# EAGLE schematic Environmental Module - Board (EAGLE 8.3.0)
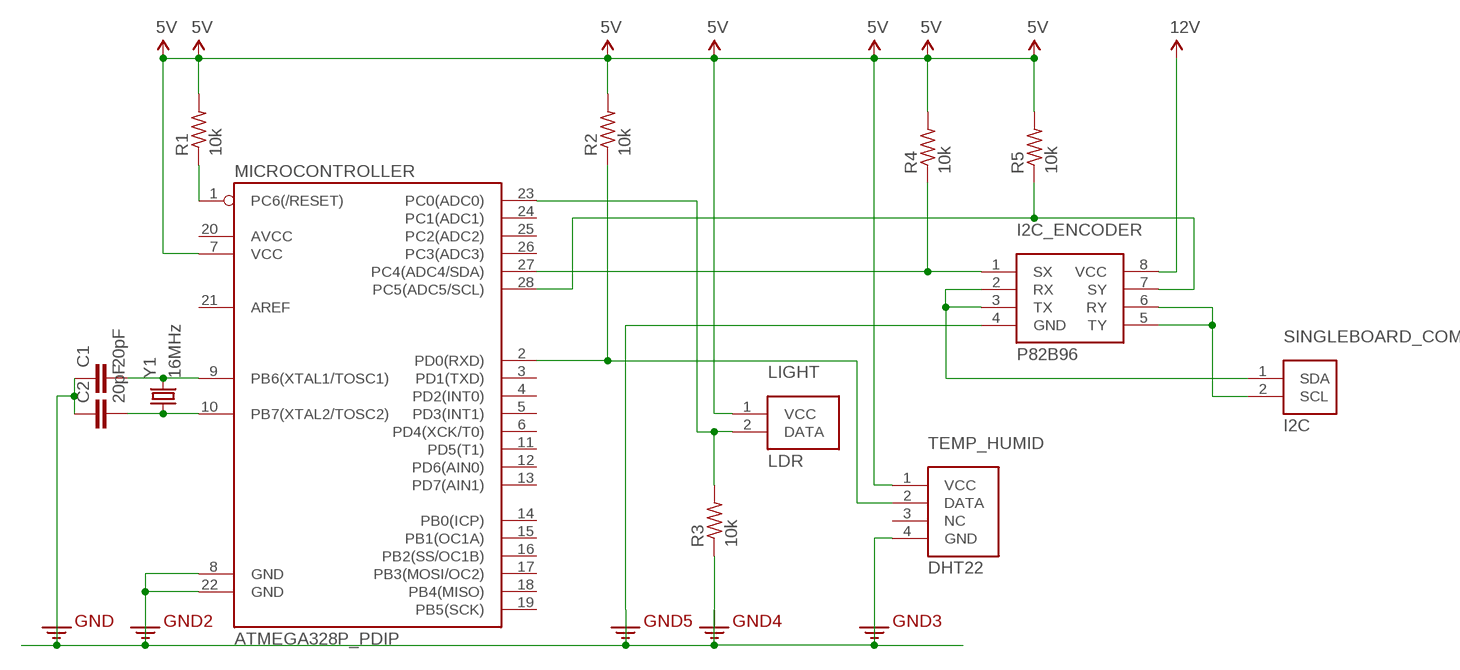
[diagram p0: schematic, sheet 1]

## Parts
C1  20pF  CAPPTH  [CAP-PTH-SMALL]
C2  20pF  CAPPTH  [CAP-PTH-SMALL]
I2C_ENCODER  P82B96  [SOIC8]
LIGHT  LDR  [LDR]
MICROCONTROLLER  ATMEGA328P_PDIP  [DIL28-3]
R1  10k  R-US_0204/7  [0204/7]
R2  10k  R-US_0204/7  [0204/7]
R3  10k  R-US_0204/7  [0204/7]
R4  10k  R-US_0204/7  [0204/7]
R5  10k  R-US_0204/7  [0204/7]
SINGLEBOARD_COMP  I2C  [LDR]
TEMP_HUMID  DHT22  [DHT22]
Y1  16MHz  CRYSTALHC49US  [HC49US]

## Nets
3.3V: C1.1 C2.1 I2C_ENCODER.4(GND) MICROCONTROLLER.8(GND) MICROCONTROLLER.22(GND) R3.1 TEMP_HUMID.4(GND) ; supply symbol labelled GND2
5V: LIGHT.1(VCC) MICROCONTROLLER.7(VCC) R1.2 R2.2 R4.2 R5.2 TEMP_HUMID.1(VCC)
12V: I2C_ENCODER.8(VCC)
N$2: I2C_ENCODER.7(SY) MICROCONTROLLER.28(PC5(ADC5/SCL)) R5.1
N$3: MICROCONTROLLER.1(PC6(/RESET)) R1.1
N$4: I2C_ENCODER.5(TY) I2C_ENCODER.6(RY) SINGLEBOARD_COMP.2(SCL)
N$5: I2C_ENCODER.1(SX) MICROCONTROLLER.27(PC4(ADC4/SDA)) R4.1
N$9: MICROCONTROLLER.2(PD0(RXD)) R2.1 TEMP_HUMID.2(DATA)
N$10: LIGHT.2(DATA) MICROCONTROLLER.23(PC0(ADC0)) R3.2
N$11: I2C_ENCODER.2(RX) I2C_ENCODER.3(TX) SINGLEBOARD_COMP.1(SDA)
N$12: C2.2 MICROCONTROLLER.10(PB7(XTAL2/TOSC2)) Y1.1
N$20: C1.2 MICROCONTROLLER.9(PB6(XTAL1/TOSC1)) Y1.2
Unconnected: MICROCONTROLLER.3(PD1(TXD)) MICROCONTROLLER.4(PD2(INT0)) MICROCONTROLLER.5(PD3(INT1)) MICROCONTROLLER.6(PD4(XCK/T0)) MICROCONTROLLER.11(PD5(T1)) MICROCONTROLLER.12(PD6(AIN0)) MICROCONTROLLER.13(PD7(AIN1)) MICROCONTROLLER.14(PB0(ICP)) MICROCONTROLLER.15(PB1(OC1A)) MICROCONTROLLER.16(PB2(SS/OC1B)) MICROCONTROLLER.17(PB3(MOSI/OC2)) MICROCONTROLLER.18(PB4(MISO)) MICROCONTROLLER.19(PB5(SCK)) MICROCONTROLLER.20(AVCC) MICROCONTROLLER.21(AREF) MICROCONTROLLER.24(PC1(ADC1)) MICROCONTROLLER.25(PC2(ADC2)) MICROCONTROLLER.26(PC3(ADC3)) TEMP_HUMID.3(NC)

## Library data of the parts
C1 C2 = SparkFun-Capacitors:CAP: Capacitor Standard 0603 ceramic capacitor, and 0.1" leaded capacitor.
I2C_ENCODER = 003_P82B96:P82B96: P82B96 - I2C buffer
LIGHT = 000_CropQuant:LDR
MICROCONTROLLER = SparkFun-DigitalIC:ATMEGA328P_PDIP: uC used in the Arduino 32kb flash, 1k EEPROM, 2k SRAM This is the through-hole version of this chip.
R1-R5 = resistor:R-US_: RESISTOR, American symbol
SINGLEBOARD_COMP = 000_CropQuant:I2C
TEMP_HUMID = 000_CropQuant:DHT22
Y1 = SparkFun-FreqCtrl:CRYSTAL: Various standard crystals. Proven footprints.